# Altium schematic sheet Main.SchDoc: Main
size A4; CompanyName: -; DrawnBy: Naldi, López; Revision: 1; SheetNumber: 1; SheetTotal: 4; Number: 25
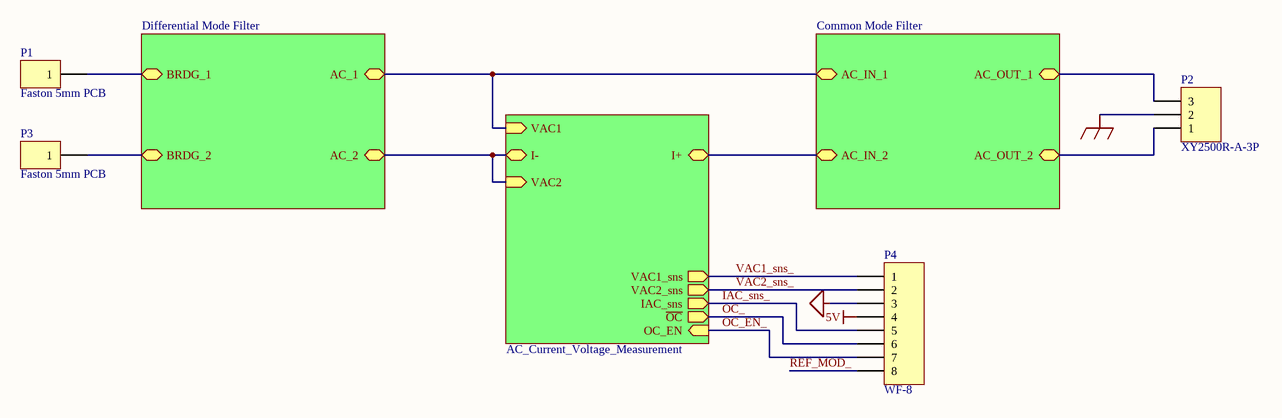
[diagram p0: Main.SchDoc]

## Parts
P1  Faston 5mm PCB  [FASTON 5mm PCB]
P2  XY2500R-A-3P  [XY2500R-A-3P]
P3  Faston 5mm PCB  [FASTON 5mm PCB]
P4  WF-8  [HDR1X8]

## Sub-sheets
AC_Current_Voltage_Measurement = AC_Current_Voltage_Measurement.SchDoc: I+ (bidir), I- (bidir), VAC1_sns (out), VAC2_sns (out), VAC1 (in), ~{OC} (out), IAC_sns (out), OC_EN (in), VAC2 (in)
Common Mode Filter = Common_Mode_Filter.SchDoc: AC_IN_2 (bidir), AC_OUT_1 (bidir), AC_OUT_2 (bidir), AC_IN_1 (bidir)
Differential Mode Filter = Differential_Mode_Filter.SchDoc: BRDG_1 (bidir), BRDG_2 (bidir), AC_1 (bidir), AC_2 (bidir)

## Nets
5V: P4.4
EARTH: P2.2
SGND: P4.3
IAC_sns_: P4.5 ; sheet AC_Current_Voltage_Measurement/IAC_sns
OC_: P4.6 ; sheet AC_Current_Voltage_Measurement/~{OC}
OC_EN_: P4.7 ; sheet AC_Current_Voltage_Measurement/OC_EN
REF_MOD_: P4.8
VAC1_sns_: P4.1 ; sheet AC_Current_Voltage_Measurement/VAC1_sns
VAC2_sns_: P4.2 ; sheet AC_Current_Voltage_Measurement/VAC2_sns
NetP1_1: P1.1 ; sheet Differential Mode Filter/BRDG_1
NetP2_1: P2.1 ; sheet Common Mode Filter/AC_OUT_2
NetP2_3: P2.3 ; sheet Common Mode Filter/AC_OUT_1
NetP3_1: P3.1 ; sheet Differential Mode Filter/BRDG_2
(unnamed): sheet Differential Mode Filter/AC_1, sheet Common Mode Filter/AC_IN_1, sheet AC_Current_Voltage_Measurement/VAC1
(unnamed): sheet Differential Mode Filter/AC_2, sheet AC_Current_Voltage_Measurement/I-, sheet AC_Current_Voltage_Measurement/VAC2
(unnamed): sheet Common Mode Filter/AC_IN_2, sheet AC_Current_Voltage_Measurement/I+

## Notes on the sheet
- Title
- Size:
- Project:
- A4
- Number:
- Revision:
- Sheet
- of
- Drawn by:
- Company:
- File:

## Library data of the parts
P1 P3 = Faston 5mm PCB: System: Connector; LatestRevisionDate: 17-Jul-2002; LatestRevisionNote: Re-released for DXP Platform.; Publisher: Altium Limited
  P1: Parameter 1: *
P2 = XY2500R-A-3P: HEADER 3P 90gra P/CI P=5MM; System: Connector; LatestRevisionDate: 17-Jul-2002; LatestRevisionNote: Re-released for DXP Platform.; Publisher: Altium Limited
P4 = Header 8: Header, 8-Pin; System: Connector; LatestRevisionDate: 17-Jul-2002; LatestRevisionNote: Re-released for DXP Platform.; Publisher: Altium Limited